# Altium schematic sheet BUTTONS.SchDoc: MISKO 3.0
size A4; Date: 19.9.2021; Author: AMADEJ PAPEŽ; SheetNumber: 10; SheetTotal: 13; SheetTitle: BUTTONS; Version: V1.1
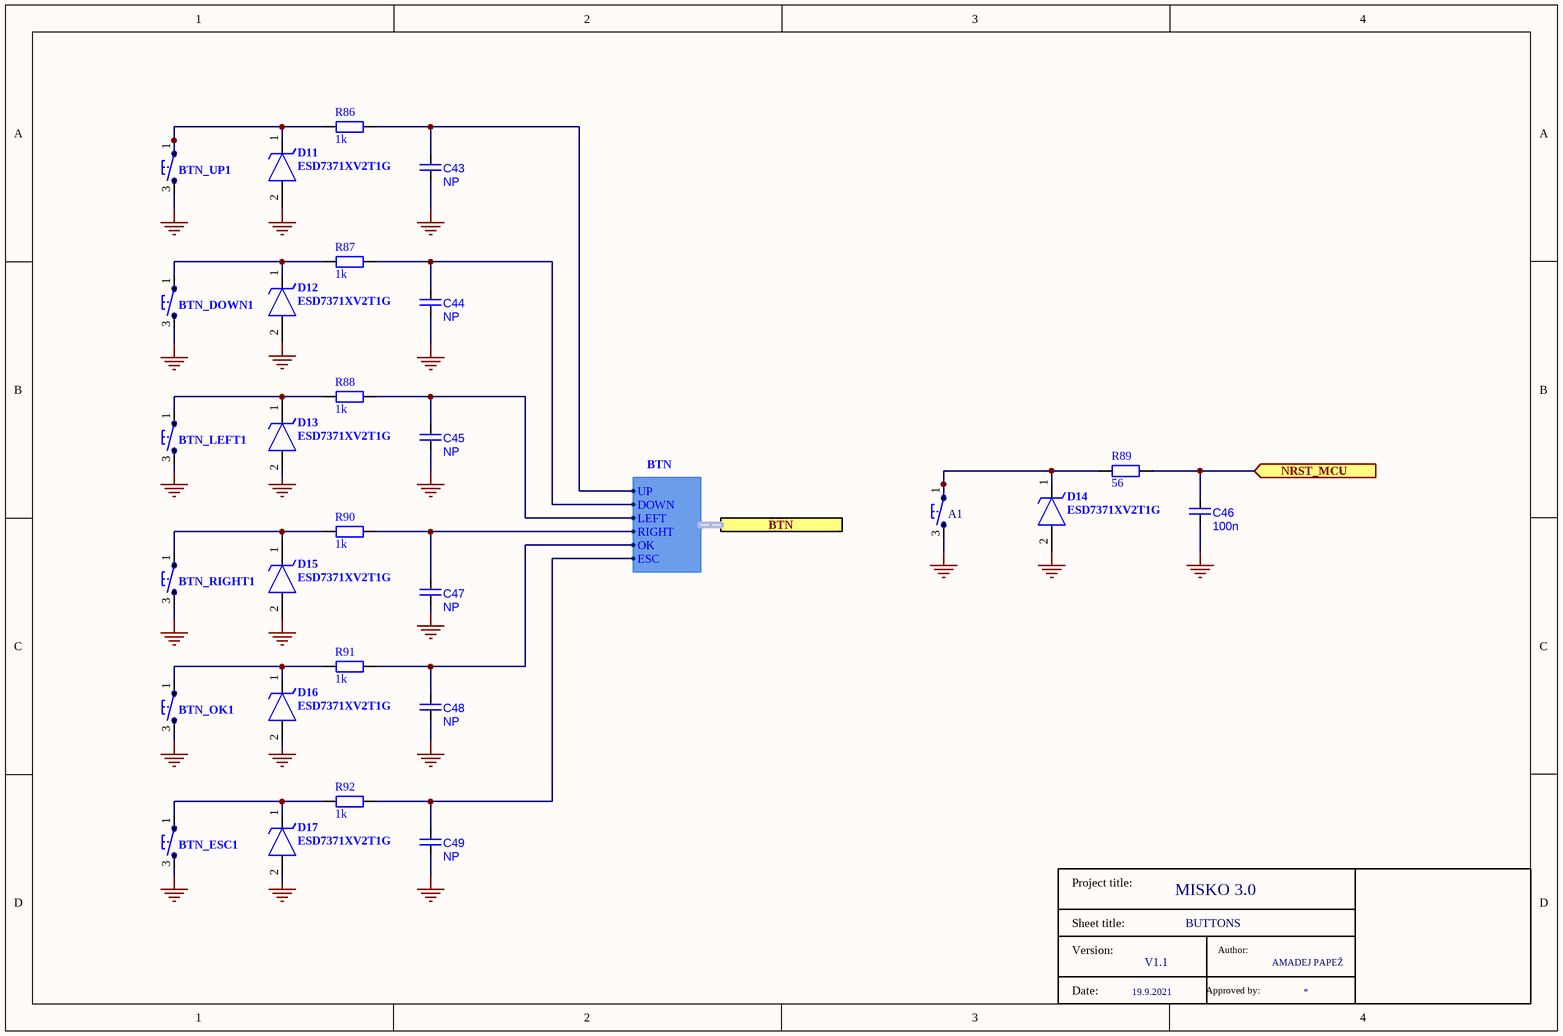
[diagram p0: BUTTONS.SchDoc]

## Parts
A1  Button_6x6  [Tipka 6x6]  (value not drawn)
BTN_DOWN1  Button_6x6  [Tipka 6x6]  (value not drawn)
BTN_ESC1  Button_6x6  [Tipka 6x6]  (value not drawn)
BTN_LEFT1  Button_6x6  [Tipka 6x6]  (value not drawn)
BTN_OK1  Button_6x6  [Tipka 6x6]  (value not drawn)
BTN_RIGHT1  Button_6x6  [Tipka 6x6]  (value not drawn)
BTN_UP1  Button_6x6  [Tipka 6x6]  (value not drawn)
C43  value NP  [C0603]
C44  value NP  [C0603]
C45  value NP  [C0603]
C46  value 100n  [C0603]
C47  value NP  [C0603]
C48  value NP  [C0603]
C49  value NP  [C0603]
D11  ESD7371XV2T1G  [SOD1608X70N]
D12  ESD7371XV2T1G  [SOD1608X70N]
D13  ESD7371XV2T1G  [SOD1608X70N]
D14  ESD7371XV2T1G  [SOD1608X70N]
D15  ESD7371XV2T1G  [SOD1608X70N]
D16  ESD7371XV2T1G  [SOD1608X70N]
D17  ESD7371XV2T1G  [SOD1608X70N]
R86  value 1k  [R1608_0603I_L]
R87  value 1k  [R1608_0603I_L]
R88  value 1k  [R1608_0603I_L]
R89  value 56  [R1608_0603I_L]
R90  value 1k  [R1608_0603I_L]
R91  value 1k  [R1608_0603I_L]
R92  value 1k  [R1608_0603I_L]
T10  (no value)

## Ports
BTN (harness BTN), NRST_MCU (in)

## Harnesses
BTN: LEFT, DOWN, RIGHT, UP, OK, ESC

## Nets
GND: A1.3 BTN_DOWN1.3 BTN_ESC1.3 BTN_LEFT1.3 BTN_OK1.3 BTN_RIGHT1.3 BTN_UP1.3 C43.1 C44.1 C45.1 C46.1 C47.1 C48.1 C49.1 D11.2(A) D12.2(A) D13.2(A) D14.2(A) D15.2(A) D16.2(A) D17.2(A)
NRST_MCU: C46.2 R89.1 ; port NRST_MCU
NetA1_1: A1.1 D14.1(K) R89.2
NetBTN_DOWN1_1: BTN_DOWN1.1 D12.1(K) R87.2
NetBTN_ESC1_1: BTN_ESC1.1 D17.1(K) R92.2
NetBTN_LEFT1_1: BTN_LEFT1.1 D13.1(K) R88.2
NetBTN_OK1_1: BTN_OK1.1 D16.1(K) R91.2
NetBTN_RIGHT1_1: BTN_RIGHT1.1 D15.1(K) R90.2
NetBTN_UP1_1: BTN_UP1.1 D11.1(K) R86.2
NetC43_2: C43.2 R86.1 ; port BTN.UP
NetC44_2: C44.2 R87.1 ; port BTN.DOWN
NetC45_2: C45.2 R88.1 ; port BTN.LEFT
NetC47_2: C47.2 R90.1 ; port BTN.RIGHT
NetC48_2: C48.2 R91.1 ; port BTN.OK
NetC49_2: C49.2 R92.1 ; port BTN.ESC

## Notes on the sheet
- (in symbol Title block) Project title:; Sheet title:; Version:; Author:; Date:; Approved by:

## Library data of the parts
A1 = Button_6x6: Tactile switch SMD; pin to pad: 1>1+2 3>3+4; Code: Q-PBUTTON; Value: Reset
BTN_DOWN1 BTN_ESC1 BTN_LEFT1 BTN_OK1 BTN_RIGHT1 BTN_UP1 = Button_6x6: Tactile switch SMD; pin to pad: 1>1+2 3>3+4; Code: Q-PBUTTON; Value: UI
C43-C49 = C: Capacitor; Code: NB6-100N
D11-D17 = ESD7371XV2T1G: TVS Diode (Uni-directional); Manufacturer_Name: ON Semiconductor; Code: KD-ESD7371X; Datasheet Link: http://www.onsemi.com/pub/Collateral/ESD7371-D.PDF; Height: 0.7mm; Manufacturer_Part_Number: ESD7371XV2T1G; Mouser Part Number: 863-ESD7371XV2T1G; Mouser Price/Stock: https://www.mouser.co.uk/ProductDetail/ON-Semiconductor/ESD7371XV2T1G?qs=dbuNSGnowt2%2F4vd%2Frk8Hiw%3D%3D; Arrow Part Number: ESD7371XV2T1G; Arrow Price/Stock: https://www.arrow.com/en/products/esd7371xv2t1g/on-semiconductor
R86-R88 R90-R92 = R: Code: LC4-1K
R89 = R: Code: LC2-56E
T10 = Title block